# EAGLE schematic Iron-Flybar-Main-PCB (EAGLE 6.4)
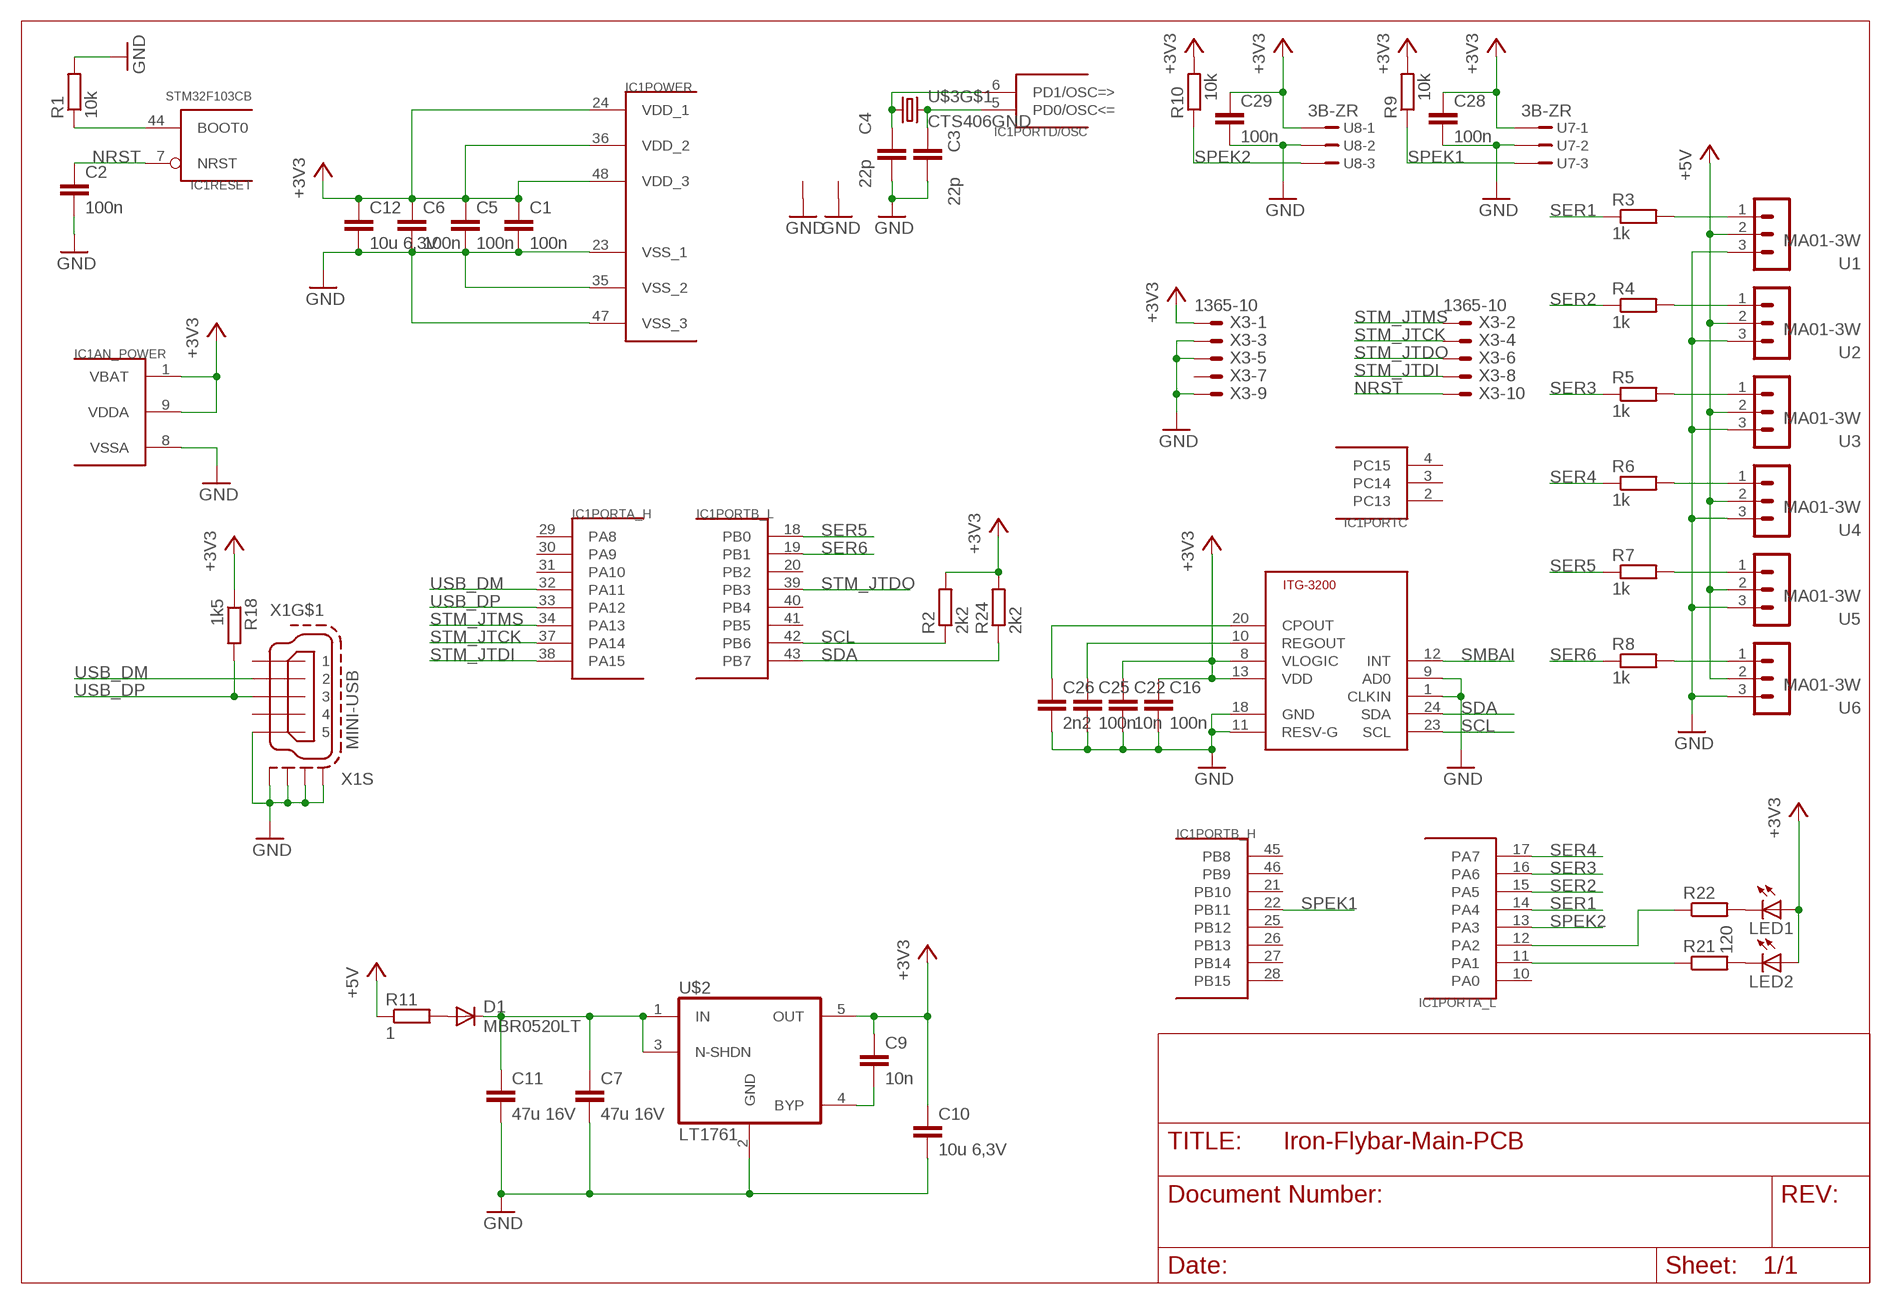
[diagram p0: schematic, sheet 1]

## Parts
C1  100n  C-EUC0603  [C0603]
C2  100n  C-EUC0603  [C0603]
C3  22p  C-EUC0603  [C0603]
C4  22p  C-EUC0603  [C0603]
C5  100n  C-EUC0603  [C0603]
C6  100n  C-EUC0603  [C0603]
C7  47u 16V  C-EUC1210K  [C1210K]
C9  10n  C-EUC0603K  [C0603K]
C10  10u 6,3V  C-EUC0603K  [C0603K]
C11  47u 16V  C-EUC1210K  [C1210K]
C12  10u 6,3V  C-EUC0603K  [C0603K]
C16  100n  C-EUC0603  [C0603]
C22  10n  C-EUC0603  [C0603]
C25  100n  C-EUC0603  [C0603]
C26  2n2  C-EUC0603  [C0603]
C28  100n  C-EUC0603  [C0603]
C29  100n  C-EUC0603  [C0603]
D1  MBR0520LT  [SOD123]
IC1  STM32F103CB  STM32F10XCXT6  [TQFP48]
LED1  LEDCHIP-LED0603  [CHIP-LED0603]
LED2  LEDCHIP-LED0603  [CHIP-LED0603]
R1  10k  R-EU_R0603  [R0603]
R2  2k2  R-EU_R0603  [R0603]
R3  1k  R-EU_R0603  [R0603]
R4  1k  R-EU_R0603  [R0603]
R5  1k  R-EU_R0603  [R0603]
R6  1k  R-EU_R0603  [R0603]
R7  1k  R-EU_R0603  [R0603]
R8  1k  R-EU_R0603  [R0603]
R9  10k  R-EU_R0603  [R0603]
R10  10k  R-EU_R0603  [R0603]
R11  1  R-EU_R0603  [R0603]
R18  1k5  R-EU_R0603  [R0603]
R21  120  R-EU_R0603  [R0603]
R22  120  R-EU_R0603  [R0603]
R24  2k2  R-EU_R0603  [R0603]
U1  MA01-3W  [MA01-3W]
U2  MA01-3W  [MA01-3W]
U3  MA01-3W  [MA01-3W]
U4  MA01-3W  [MA01-3W]
U5  MA01-3W  [MA01-3W]
U6  MA01-3W  [MA01-3W]
U7  3B-ZR  [S3B-ZR]
U8  3B-ZR  [S3B-ZR]
U$1  ITG-3200  [ITG-3200]
U$2  LT1761  [TSOT23-5]
U$3  CTS406GND  [CTS406]
X1  MINI-USB  MINI-USB-SCHIELD-32005-301  [32005-301]
X3  1365-10  [1365-10]

## Nets
+3V3: C1.1 C5.1 C6.1 C9.1 C10.1 C12.1 C16.1 C22.1 C28.1 C29.1 IC1.1(AN_POWER:VBAT) IC1.9(AN_POWER:VDDA) IC1.24(POWER:VDD_1) IC1.36(POWER:VDD_2) IC1.48(POWER:VDD_3) LED1.A LED2.A R2.2 R9.2 R10.2 R18.1 R24.2 U7.1 U8.1 U$1.8(VLOGIC) U$1.13(VDD) U$2.5(OUT) X3.1
+5V: R11.1 U1.2 U2.2 U3.2 U4.2 U5.2 U6.2
GND: C1.2 C2.2 C3.2 C4.2 C5.2 C6.2 C7.2 C10.2 C11.2 C12.2 C16.2 C22.2 C25.2 C26.2 C28.2 C29.2 IC1.8(AN_POWER:VSSA) IC1.23(POWER:VSS_1) IC1.35(POWER:VSS_2) IC1.47(POWER:VSS_3) R1.2 U1.3 U2.3 U3.3 U4.3 U5.3 U6.3 U7.2 U8.2 U$1.1(CLKIN) U$1.9(AD0) U$1.11(RESV-G) U$1.18(GND) U$2.2(GND) U$3.2(GND) U$3.4(GND) X1.5 X1.M1(S:S1) X1.M2(S:S2) X1.M3(S:S3) X1.M4(S:S4) X3.3 X3.5 X3.9
N$1: R8.2 U6.1
N$2: C4.1 IC1.6(PORTD/OSC:PD1/OSC=>) U$3.1
N$3: R7.2 U5.1
N$4: R6.2 U4.1
N$5: R5.2 U3.1
N$6: R4.2 U2.1
N$7: R3.2 U1.1
N$8: IC1.44(RESET:BOOT0) R1.1
N$11: C3.1 IC1.5(PORTD/OSC:PD0/OSC<=) U$3.3
N$12: LED1.C R22.2
N$13: IC1.11(PORTA_L:PA1) R21.1
N$14: IC1.12(PORTA_L:PA2) R22.1
N$15: C9.2 U$2.4(BYP)
N$16: LED2.C R21.2
N$17: D1.A R11.2
N$18: C25.1 U$1.10(REGOUT)
N$19: C26.1 U$1.20(CPOUT)
N$23: C7.1 C11.1 D1.C U$2.1(IN) U$2.3(N-SHDN)
NRST: C2.1 IC1.7(RESET:NRST) X3.10
SCL: IC1.42(PORTB_L:PB6) R2.1 U$1.23(SCL)
SDA: IC1.43(PORTB_L:PB7) R24.1 U$1.24(SDA)
SER1: IC1.14(PORTA_L:PA4) R3.1
SER2: IC1.15(PORTA_L:PA5) R4.1
SER3: IC1.16(PORTA_L:PA6) R5.1
SER4: IC1.17(PORTA_L:PA7) R6.1
SER5: IC1.18(PORTB_L:PB0) R7.1
SER6: IC1.19(PORTB_L:PB1) R8.1
SMBAI: U$1.12(INT)
SPEK1: IC1.22(PORTB_H:PB11) R9.1 U7.3
SPEK2: IC1.13(PORTA_L:PA3) R10.1 U8.3
STM_JTCK: IC1.37(PORTA_H:PA14) X3.4
STM_JTDI: IC1.38(PORTA_H:PA15) X3.8
STM_JTDO: IC1.39(PORTB_L:PB3) X3.6
STM_JTMS: IC1.34(PORTA_H:PA13) X3.2
USB_DM: IC1.32(PORTA_H:PA11) X1.2
USB_DP: IC1.33(PORTA_H:PA12) R18.2 X1.3
Unconnected: IC1.2(PORTC:PC13) IC1.3(PORTC:PC14) IC1.4(PORTC:PC15) IC1.10(PORTA_L:PA0) IC1.20(PORTB_L:PB2) IC1.21(PORTB_H:PB10) IC1.25(PORTB_H:PB12) IC1.26(PORTB_H:PB13) IC1.27(PORTB_H:PB14) IC1.28(PORTB_H:PB15) IC1.29(PORTA_H:PA8) IC1.30(PORTA_H:PA9) IC1.31(PORTA_H:PA10) IC1.40(PORTB_L:PB4) IC1.41(PORTB_L:PB5) IC1.45(PORTB_H:PB8) IC1.46(PORTB_H:PB9) X1.1 X1.4 X3.7

## Library data of the parts
C1-C7 C9-C12 C16 C22 C25 C26 C28 C29 = rcl:C-EU: CAPACITOR, European symbol
D1 = diode:MBR0520LT: SCHOTTKY BARRIER RECTIFIER Source: http://onsemi.com .. MBR0520LT1-D.pdf
IC1 = stm32:STM32F10XCXT6: ST STM32F101/103 48pin LQFP
LED1 LED2 = led:LED: LED OSRAM: - CHIPLED LG R971, LG N971, LY N971, LG Q971, LY Q971, LO R971, LY R971 LH N974, LH R974 LS Q976, LO Q976, LY Q976 LO Q996 - Hyper CHIPLED LW Q18S LB Q993, LB Q99A, LB R99A - SideLED LS A670, LO A670, LY A670, LG A670, LP A670 LB A673, LV A673, LT A673, LW A673 LH A674 LY A675 LS A676, LA A676, LO A676, LY A676, LW A676 LS A679, LY A679, LG A679 - Hyper Micro SIDELED® LS Y876, LA Y876, LO Y876, LY Y876 LT Y87S - SmartLED LW L88C, LW L88S LB L89C, LB L89S, LG L890 LS L89K, LO L89K, LY L89K LS L896, LA L896, LO L896, LY L896 - TOPLED LS T670, LO T670, LY T670, LG T670, LP T670 LSG T670, LSP T670, LSY T670, LOP T670, LYG T670 LG T671, LOG T671, LSG T671 LB T673, LV T673, LT T673, LW T673 LH T674 LS T676, LA T676, LO T676, LY T676, LB T676, LH T676, LSB T676, LW T676 LB T67C, LV T67C, LT T67C, LS T67K, LO T67K, LY T67K, LW E67C LS E67B, LA E67B, LO E67B, LY E67B, LB E67C, LV E67C, LT E67C LW T67C LS T679, LY T679, LG T679 LS T770, LO T770, LY T770, LG T770, LP T770 LB T773, LV T773, LT T773, LW T773 LH T774 LS E675, LA E675, LY E675, LS T675 LS T776, LA T776, LO T776, LY T776, LB T776 LHGB T686 LT T68C, LB T68C - Hyper Mini TOPLED® LB M676 - Mini TOPLED Santana® LG M470 LS M47K, LO M47K, LY M47K Source: http://www.osram.convergy.de LUXEON: - LUMILED® LXK2-PW12-R00, LXK2-PW12-S00, LXK2-PW14-U00, LXK2-PW14-V00 LXK2-PM12-R00, LXK2-PM12-S00, LXK2-PM14-U00 LXK2-PE12-Q00, LXK2-PE12-R00, LXK2-PE12-S00, LXK2-PE14-T00, LXK2-PE14-U00 LXK2-PB12-K00, LXK2-PB12-L00, LXK2-PB12-M00, LXK2-PB14-N00, LXK2-PB14-P00, LXK2-PB14-Q00 LXK2-PR12-L00, LXK2-PR12-M00, LXK2-PR14-Q00, LXK2-PR14-R00 LXK2-PD12-Q00, LXK2-PD12-R00, LXK2-PD12-S00 LXK2-PH12-R00, LXK2-PH12-S00 LXK2-PL12-P00, LXK2-PL12-Q00, LXK2-PL12-R00 Source: www.luxeon.com KINGBRIGHT: KA-3528ASYC Source: www.kingbright.com
R1-R11 R18 R21 R22 R24 = rcl:R-EU_: RESISTOR, European symbol
U1-U6 = con-lstb:MA01-3W
U7 U8 = con-jst:?3B-ZR
U$1 = invensense:ITG-3200
U$2 = linear-technology-2:LT1761
U$3 = crystal:CTS406GND
X1 = con-cypressindustries:MINI-USB-SCHIELD-: MINI USB-B Conector Source: www.cypressindustries.com; OC_FARNELL: unknown; OC_NEWARK: unknown
X3 = con-leotronics:1365-10: DUAL ROW STRAIGHT HEADER 1364 SERIES. 1.27mm x 1.27mm. Without Fixing Post. SMT Source: http://www.leotronics.co.uk/Conexcon/Data%20Sheets/sec.%20A/1364ing.pdf; OC_FARNELL: unknown; OC_NEWARK: unknown

## Net classes
0 default: width 0.279 mm, drill 0.254 mm, clearance 0.254 mm